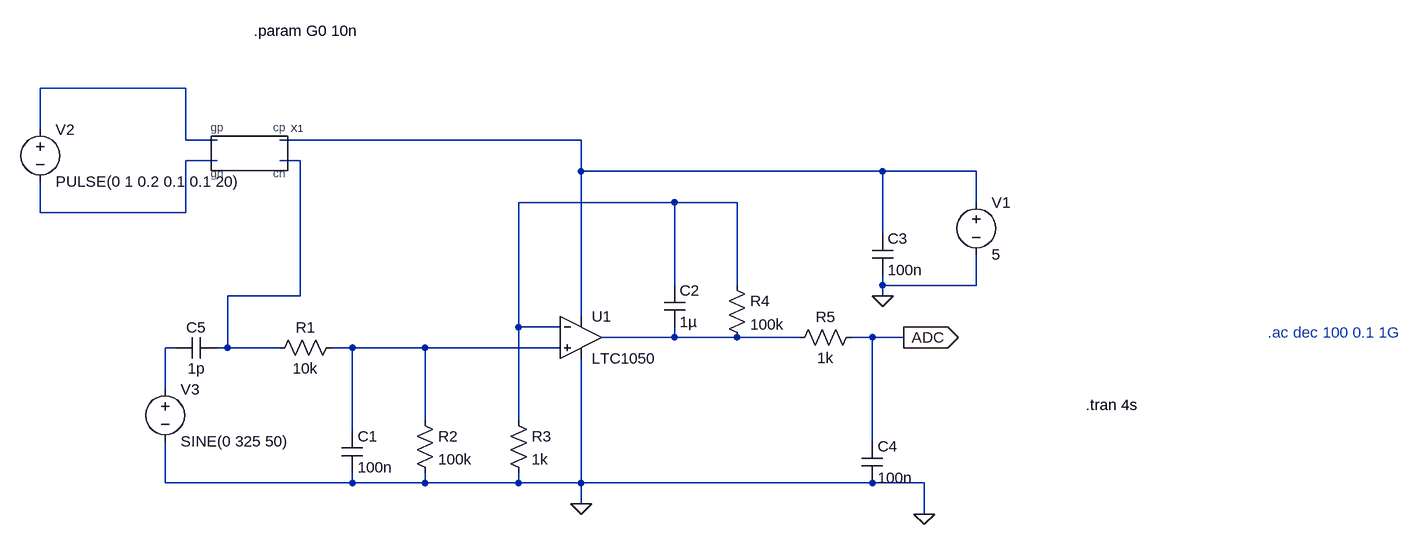
[diagram p0: schematic Schematique_ampli_V2.asc]
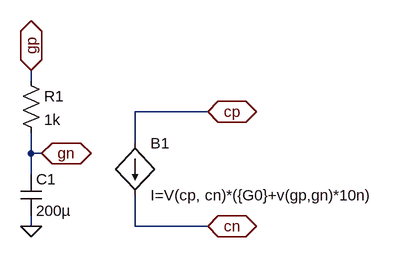
[diagram p1: sub-circuit capteur_gaz.asc]
Schematique_ampli_V2.asc, the LTspice schematic file:
Version 4
SHEET 1 1720 680
WIRE -160 -288 -384 -288
WIRE -384 -224 -384 -288
WIRE -160 -208 -160 -288
WIRE -112 -208 -160 -208
WIRE 448 -208 -16 -208
WIRE -112 -176 -160 -176
WIRE 16 -176 -16 -176
WIRE 448 -160 448 -208
WIRE 912 -160 448 -160
WIRE 1056 -160 912 -160
WIRE 592 -112 352 -112
WIRE 688 -112 592 -112
WIRE 1056 -112 1056 -160
WIRE -384 -96 -384 -144
WIRE -160 -96 -160 -176
WIRE -160 -96 -384 -96
WIRE 912 -64 912 -160
WIRE 592 16 592 -112
WIRE 688 16 688 -112
WIRE 912 16 912 0
WIRE 1056 16 1056 -32
WIRE 1056 16 912 16
WIRE 16 32 16 -176
WIRE 16 32 -96 32
WIRE 912 32 912 16
WIRE 448 64 448 -160
WIRE 352 80 352 -112
WIRE 416 80 352 80
WIRE 592 96 592 80
WIRE 592 96 480 96
WIRE 688 96 592 96
WIRE 784 96 688 96
WIRE 896 96 864 96
WIRE 944 96 896 96
WIRE -176 112 -192 112
WIRE -96 112 -96 32
WIRE -96 112 -112 112
WIRE -16 112 -96 112
WIRE 96 112 64 112
WIRE 208 112 96 112
WIRE 416 112 208 112
WIRE -192 176 -192 112
WIRE 208 224 208 112
WIRE 352 224 352 80
WIRE 96 240 96 112
WIRE 896 256 896 96
WIRE -192 320 -192 256
WIRE 96 320 96 304
WIRE 96 320 -192 320
WIRE 208 320 208 304
WIRE 208 320 96 320
WIRE 352 320 352 304
WIRE 352 320 208 320
WIRE 448 320 448 128
WIRE 448 320 352 320
WIRE 896 320 448 320
WIRE 976 320 896 320
WIRE 448 352 448 320
WIRE 976 368 976 320
FLAG 448 352 0
FLAG 976 368 0
FLAG 912 32 0
FLAG 944 96 ADC
IOPIN 944 96 Out
SYMBOL res 80 96 R90
WINDOW 0 0 56 VBottom 2
WINDOW 3 32 56 VTop 2
SYMATTR InstName R1
SYMATTR Value 10k
SYMATTR SpiceLine tol=1 pwr=0.1
SYMBOL res 192 208 R0
SYMATTR InstName R2
SYMATTR Value 100k
SYMBOL res 336 208 R0
SYMATTR InstName R3
SYMATTR Value 1k
SYMBOL res 672 0 R0
SYMATTR InstName R4
SYMATTR Value 100k
SYMBOL res 880 80 R90
WINDOW 0 0 56 VBottom 2
WINDOW 3 32 56 VTop 2
SYMATTR InstName R5
SYMATTR Value 1k
SYMBOL cap 80 240 R0
SYMATTR InstName C1
SYMATTR Value 100n
SYMBOL cap 576 16 R0
SYMATTR InstName C2
SYMATTR Value 1µ
SYMBOL cap 896 -64 R0
SYMATTR InstName C3
SYMATTR Value 100n
SYMBOL cap 880 256 R0
SYMATTR InstName C4
SYMATTR Value 100n
SYMBOL OpAmps\\LTC1050 448 32 R0
SYMATTR InstName U1
SYMBOL voltage 1056 -128 R0
WINDOW 123 0 0 Left 0
WINDOW 39 0 0 Left 0
SYMATTR InstName V1
SYMATTR Value 5
SYMBOL voltage -384 -240 R0
WINDOW 123 0 0 Left 0
WINDOW 39 0 0 Left 0
SYMATTR InstName V2
SYMATTR Value PULSE(0 1 0.2 0.1 0.1 20)
SYMBOL voltage -192 160 R0
WINDOW 123 0 0 Left 0
WINDOW 39 0 0 Left 0
SYMATTR InstName V3
SYMATTR Value SINE(0 325 50)
SYMBOL cap -112 96 R90
WINDOW 0 0 32 VBottom 2
WINDOW 3 32 32 VTop 2
SYMATTR InstName C5
SYMATTR Value 1p
SYMBOL Capteur_Gaz -64 -192 R0
SYMATTR InstName X1
TEXT 1224 200 Left 2 !.tran 4s
TEXT 1504 88 Left 2 ;.ac dec 100 0.1 1G
TEXT -56 -376 Left 2 !.param G0 10n

capteur_gaz.asc, the sub-circuit schematic file:
Version 4
SHEET 1 880 680
WIRE -48 0 -48 -16
WIRE 224 48 112 48
WIRE 112 96 112 48
WIRE -48 112 -48 80
WIRE -32 112 -48 112
WIRE -48 144 -48 112
WIRE -48 224 -48 208
WIRE 112 224 112 176
WIRE 224 224 112 224
FLAG 224 48 cp
IOPIN 224 48 BiDir
FLAG 224 224 cn
IOPIN 224 224 BiDir
FLAG -48 224 0
FLAG -48 -16 gp
IOPIN -48 -16 BiDir
FLAG -32 112 gn
IOPIN -32 112 BiDir
SYMBOL bi 112 96 R0
SYMATTR InstName B1
SYMATTR Value I=V(cp, cn)*({G0}+v(gp,gn)*10n)
SYMBOL res -64 -16 R0
SYMATTR InstName R1
SYMATTR Value 1k
SYMBOL cap -64 144 R0
SYMATTR InstName C1
SYMATTR Value 200µ

The netlist it stands for:
* Schematique_ampli_V2.asc
R1 N008 N004 10k tol=1 pwr=0.1
R2 N008 0 100k
R3 N005 0 1k
R4 N005 N006 100k
R5 ADC N006 1k
C1 N008 0 100n
C2 N005 N006 1µ
C3 N002 0 100n
C4 ADC 0 100n
XU1 N008 N005 N002 0 N006 LTC1050  ; pins In+ In- V+ V- OUT
V1 N002 0 5
V2 N001 N003 PULSE(0 1 0.2 0.1 0.1 20)
V3 N007 0 SINE(0 325 50)
C5 N004 N007 1p
XX1 N001 N003 N002 N004 capteur_gaz

* block symbol definitions
.subckt capteur_gaz gp gn cp cn
B1 cp cn I=V(cp, cn)*({G0}+v(gp,gn)*10n)
R1 gp gn 1k
C1 gn 0 200µ
.ends capteur_gaz

.tran 4s
* .ac dec 100 0.1 1G
.param G0 10n
.lib LTC.lib
.backanno
.end